# Altium schematic sheet BatteryNode.SchDoc
size A4
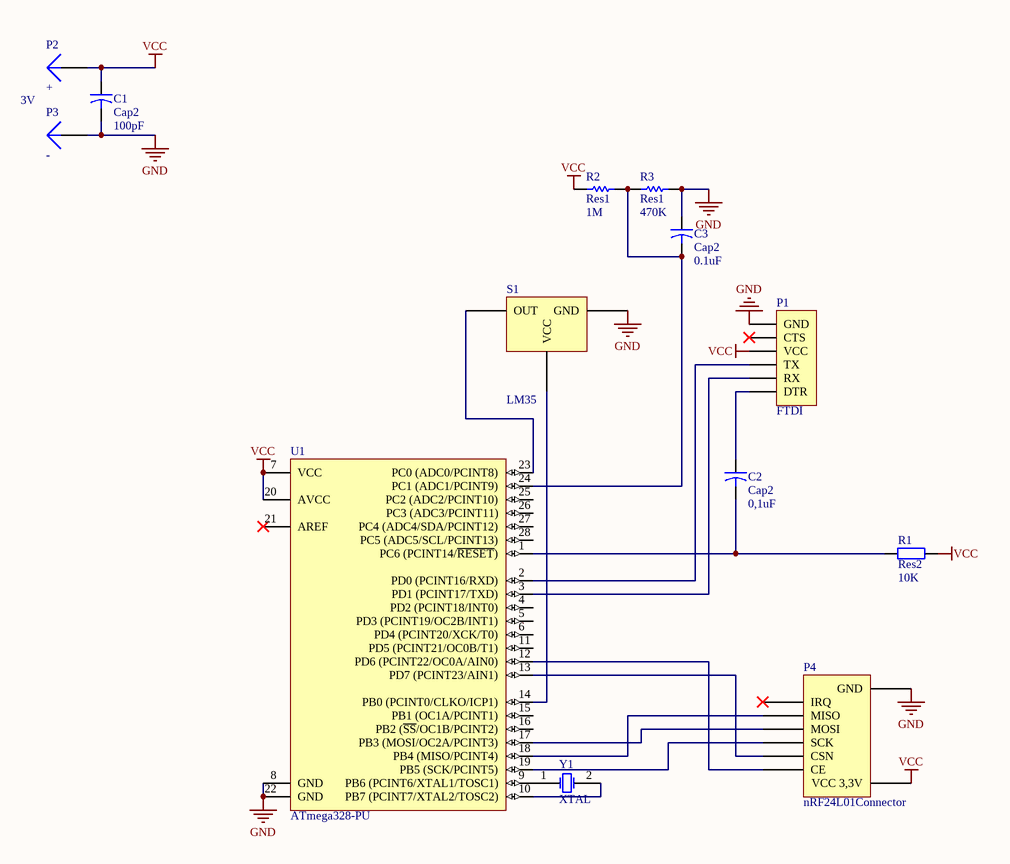
[diagram p0: BatteryNode.SchDoc]

## Parts
C1  Cap2  value 100pF  [CAPR5-4X5]
C2  Cap2  value 0,1uF  [CAPR5-4X5]
C3  Cap2  value 0.1uF  [CAPR5-4X5]
P1  FTDI  [HDR1X6]
P2  +  [PIN1]
P3  -  [PIN1]
P4  nRF24L01Connector  [HDR2X4]
R1  Res2  value 10K  [AXIAL-0.4]
R2  Res1  value 1M  [AXIAL-0.3]
R3  Res1  value 470K  [AXIAL-0.3]
S1  LM35  [TO-92]
U1  ATmega328-PU  [28P3]
Y1  XTAL  [R38]

## Nets
GND: C1.2 C3.1 P1.1(GND) P3.1 P4.2(GND) R3.2 S1.3(GND) U1.8(GND) U1.22(GND)
VCC: C1.1 P1.3(VCC) P2.1 P4.1(VCC_3,3V) R1.2 R2.1 U1.7(VCC) U1.20(AVCC)
NetC2_1: C2.1 P1.6(DTR)
NetC2_2: C2.2 R1.1 U1.1(PC6_(PCINT14/~{RESET}))
NetC3_2: C3.2 R2.2 R3.1 U1.24(PC1_(ADC1/PCINT9))
NetP1_4: P1.4(TX) U1.2(PD0_(PCINT16/RXD))
NetP1_5: P1.5(RX) U1.3(PD1_(PCINT17/TXD))
NetP4_3: P4.3(CE) U1.12(PD6_(PCINT22/OC0A/AIN0))
NetP4_4: P4.4(CSN) U1.13(PD7_(PCINT23/AIN1))
NetP4_5: P4.5(SCK) U1.19(PB5_(SCK/PCINT5))
NetP4_6: P4.6(MOSI) U1.17(PB3_(MOSI/OC2A/PCINT3))
NetP4_7: P4.7(MISO) U1.18(PB4_(MISO/PCINT4))
NetS1_1: S1.1(VCC) U1.14(PB0_(PCINT0/CLKO/ICP1))
NetS1_2: S1.2(OUT) U1.23(PC0_(ADC0/PCINT8))
NetU1_9: U1.9(PB6_(PCINT6/XTAL1/TOSC1)) Y1.1(OSC1)
NetU1_10: U1.10(PB7_(PCINT7/XTAL2/TOSC2)) Y1.2(OSC2)

Not connected (* = marked no-connect by the designer): P1 2(CTS)*; P4 8(IRQ)*; U1 4(PD2_(PCINT18/INT0)) 5(PD3_(PCINT19/OC2B/INT1)) 6(PD4_(PCINT20/XCK/T0)) 11(PD5_(PCINT21/OC0B/T1)) 15(PB1_(OC1A/PCINT1)) 16(PB2_(~{SS}/OC1B/PCINT2)) 21(AREF)* 25(PC2_(ADC2/PCINT10)) 26(PC3_(ADC3/PCINT11)) 27(PC4_(ADC4/SDA/PCINT12)) 28(PC5_(ADC5/SCL/PCINT13))

## Notes on the sheet
- 3V

## Library data of the parts
C1-C3 = Cap2: Capacitor; Published: 23-Sep-2002; PackageReference: CAPR5-4X5; Publisher: Altium Limited; PackageDescription: Capacitor; 2 Leads
P1 = Header 6: Header, 6-Pin; LatestRevisionDate: 17-Jul-2002; LatestRevisionNote: Re-released for DXP Platform.; Publisher: Altium Limited
P2 P3 = Plug: LatestRevisionDate: 17-Jul-2002; LatestRevisionNote: Re-released for DXP Platform.; Publisher: Altium Limited
R1 = Res2: Resistor; Published: 8-Jun-2000; LatestRevisionDate: 17-Jul-2002; LatestRevisionNote: Re-released for DXP Platform.; PackageReference: AXIAL-0.4; Publisher: Altium Limited; PackageDescription: Axial Device, Thru-Hole; 2 Leads; 0.4 in Pin Spacing
R2 R3 = Res1: Resistor; Published: 8-Jun-2000; LatestRevisionDate: 17-Jul-2002; LatestRevisionNote: Re-released for DXP Platform.; PackageReference: AXIAL-0.3; Publisher: Altium Limited; PackageDescription: Axial Device, Thru-Hole; 2 Leads; 0.3 in Pin Spacing
U1 = ATmega328-PU: 8-bit AVR Microcontroller, 32KB Flash, 1KB EEPROM, 2KB SRAM, 28-pin PDIP, Industrial Grade (-40°C to 85°C); Published: 1-Apr-2010; DatasheetVersion: revA, Jan-2010; PackageVersion: revB, Sep-2001; PackageReference: 28P3; Publisher: Altium Limited; PackageDescription: 28-lead (0.300"/7.62mm Wide) Plastic Dual Inline Package (PDIP); Supplier 1: Digi-Key; Supplier Part Number 1: ATMEGA328-PU-ND; Supplier 2: Mouser; Supplier Part Number 2: 556-ATMEGA328-PU; ComponentLink1Description: Manufacturer Link; ComponentLink1URL: http://www.atmel.com/products/avr/default.asp?; ComponentLink2Description: ATmega48A/48PA/88A/88PA/168A/168PA/328/328P Datasheet; ComponentLink2URL: http://www.atmel.com/dyn/resources/prod_documents/8271.pdf; ComponentLink3Description: ATmega48A/48PA/88A/88PA/168A/168PA/328/328P Summary; ComponentLink3URL: http://www.atmel.com/dyn/resources/prod_documents/8271S.pdf; ComponentLink4Description: Atmel.com Home; ComponentLink4URL: http://www.atmel.com
Y1 = XTAL: Crystal Oscillator; Published: 8-Jun-2000; LatestRevisionDate: 17-Jul-2002; LatestRevisionNote: Re-released for DXP Platform.; PackageReference: R38; Publisher: Altium Limited; PackageDescription: Crystal, Thru-Hole; 2 Leads; Body 3.1 x 8.2 mm (Dia.xH)